# EAGLE schematic fever meter v1 (EAGLE 7.2.0)
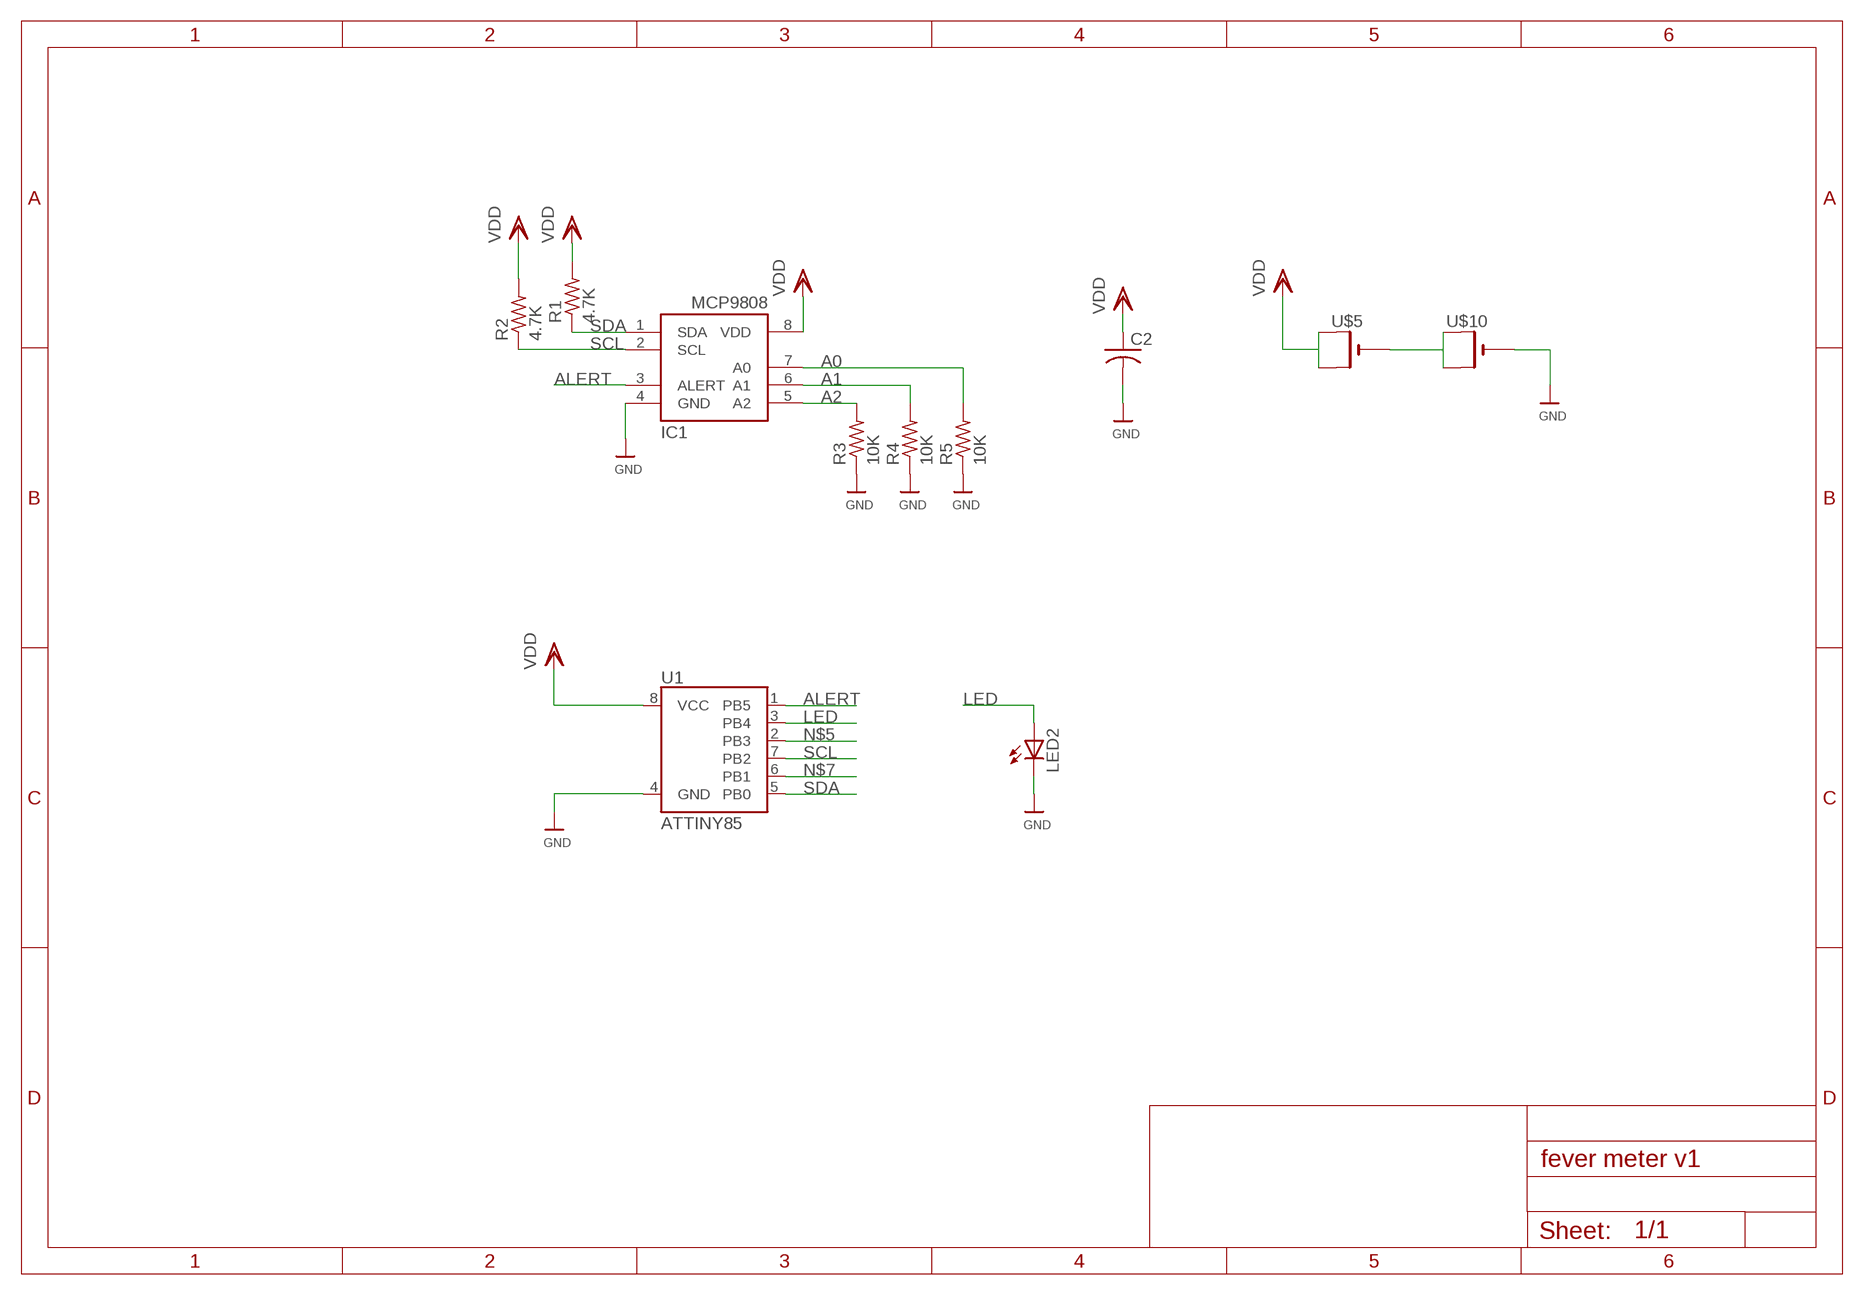
[diagram p0: schematic, sheet 1]

## Parts
C2  C-USC1206  [C1206]
IC1  MCP9808-E/MS  [MSOP8_0.65MM]
LED2  LEDSMT1206  [1206]
R1  4.7K  R-US_M1206  [M1206]
R2  4.7K  R-US_M1206  [M1206]
R3  10K  R-US_M1206  [M1206]
R4  10K  R-US_M1206  [M1206]
R5  10K  R-US_M1206  [M1206]
U1  ATTINY85  [ATTINY85]
U$5  CR1220SMT  [CR1220-SMD]
U$10  CR1220SMT  [CR1220-SMD]

## Nets
A0: IC1.7(A0) R5.2
A1: IC1.6(A1) R4.2
A2: IC1.5(A2) R3.2
ALERT: IC1.3(ALERT) U1.1(PB5)
GND: C2.2 IC1.4(GND) LED2.C R3.1 R4.1 R5.1 U1.4(GND) U$10.-
LED: LED2.A U1.3(PB4)
N$3: U$5.- U$10.+$1(+) U$10.+$2(+1)
N$5: U1.2(PB3)
N$7: U1.6(PB1)
SCL: IC1.2(SCL) R2.1 U1.7(PB2)
SDA: IC1.1(SDA) R1.1 U1.5(PB0)
VDD: C2.1 IC1.8(VDD) R1.2 R2.2 U1.8(VCC) U$5.+$1(+) U$5.+$2(+1)

## Library data of the parts
C2 = adafruit:C-US: CAPACITOR, American symbol
IC1 = microbuilder:MCP9808
LED2 = adafruit:LED: LED OSRAM: - CHIPLED LG R971, LG N971, LY N971, LG Q971, LY Q971, LO R971, LY R971 LH N974, LH R974 LS Q976, LO Q976, LY Q976 LO Q996 - Hyper CHIPLED LW Q18S LB Q993, LB Q99A, LB R99A - SideLED LS A670, LO A670, LY A670, LG A670, LP A670 LB A673, LV A673, LT A673, LW A673 LH A674 LY A675 LS A676, LA A676, LO A676, LY A676, LW A676 LS A679, LY A679, LG A679 - Hyper Micro SIDELED® LS Y876, LA Y876, LO Y876, LY Y876 LT Y87S - SmartLED LW L88C, LW L88S LB L89C, LB L89S, LG L890 LS L89K, LO L89K, LY L89K LS L896, LA L896, LO L896, LY L896 - TOPLED LS T670, LO T670, LY T670, LG T670, LP T670 LSG T670, LSP T670, LSY T670, LOP T670, LYG T670 LG T671, LOG T671, LSG T671 LB T673, LV T673, LT T673, LW T673 LH T674 LS T676, LA T676, LO T676, LY T676, LB T676, LH T676, LSB T676, LW T676 LB T67C, LV T67C, LT T67C, LS T67K, LO T67K, LY T67K, LW E67C LS E67B, LA E67B, LO E67B, LY E67B, LB E67C, LV E67C, LT E67C LW T67C LS T679, LY T679, LG T679 LS T770, LO T770, LY T770, LG T770, LP T770 LB T773, LV T773, LT T773, LW T773 LH T774 LS E675, LA E675, LY E675, LS T675 LS T776, LA T776, LO T776, LY T776, LB T776 LHGB T686 LT T68C, LB T68C - Hyper Mini TOPLED® LB M676 - Mini TOPLED Santana® LG M470 LS M47K, LO M47K, LY M47K Source: http://www.osram.convergy.de/
R1-R5 = adafruit:R-US_: RESISTOR, American symbol
U1 = SparkFun-IC-Microcontroller:ATTINY85; PROD_ID: IC-09092
U$5 U$10 = adafruit:CR1220: CR1216/CR1220/CR1225 12mm 3V lithium coin cell Great for battery packup. Both SMT and THM holders. Note the THM package has the ground pads on both sides of the PCB so that the masks are the same - this reduces the cost